# EAGLE design ASL1001 (EAGLE 6.3)
DATABASE: ./../../../../../Components/TinyCircuits_Part_Database.txt
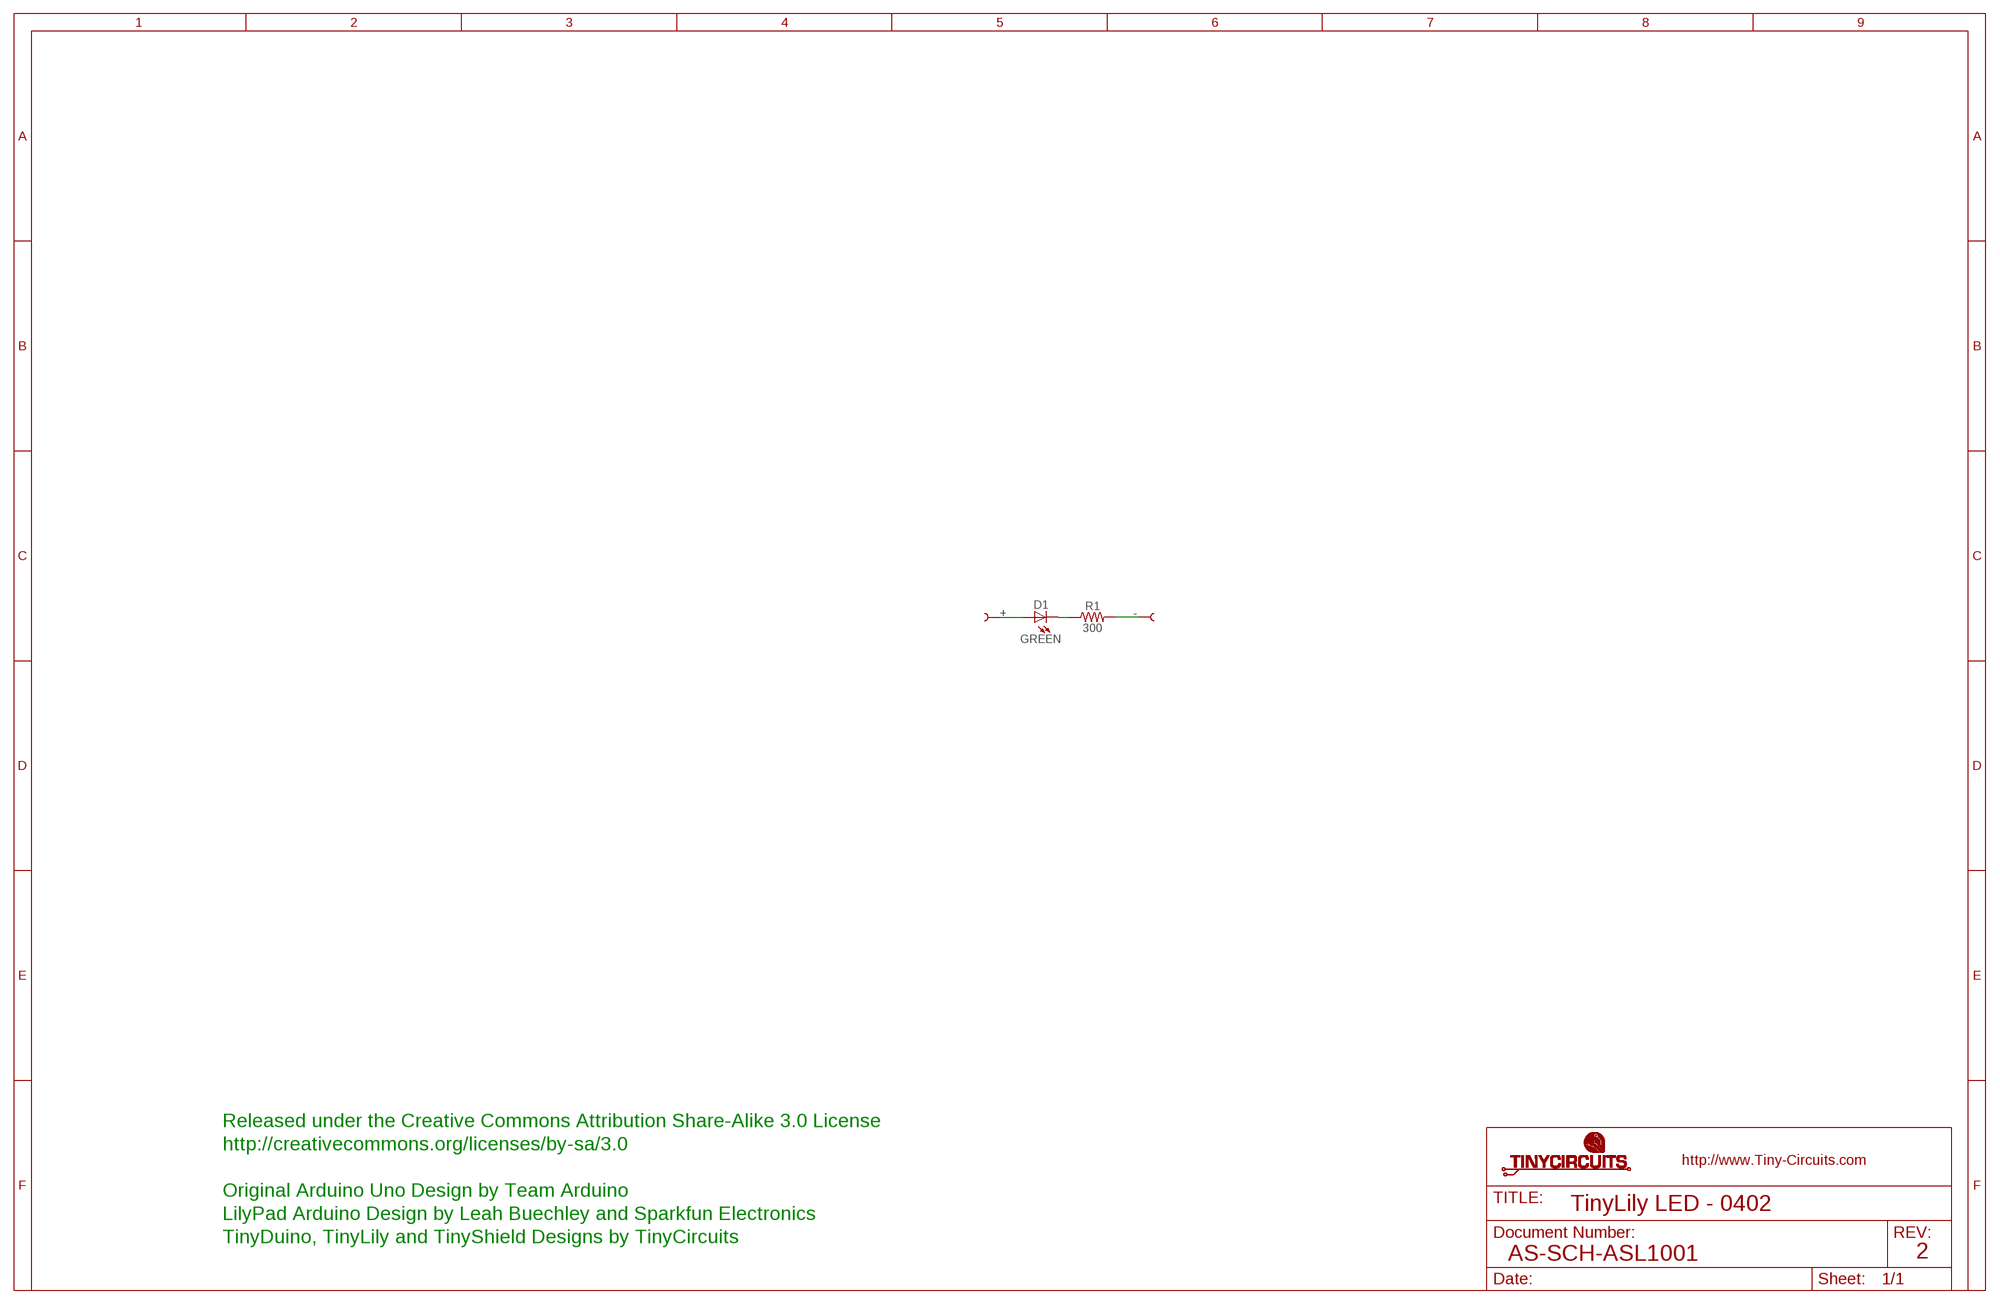
[diagram p0: schematic, sheet 1]

## Parts
D1  GREEN  AS-ITM-00038  [0402_LED]
R1  300  AS-ITM-00016  [0402]
U$1  SEWTABTH_0402  [SEWTAP_TH_0402]
U$7  SEWTABTH_0402  [SEWTAP_TH_0402]

## Nets
+: D1.1(A) U$7.1
-: R1.2 U$1.1
N$2: D1.2(C) R1.1

## Notes on the sheet
- Released under the Creative Commons Attribution Share-Alike 3.0 License
- http://creativecommons.org/licenses/by-sa/3.0
- Original Arduino Uno Design by Team Arduino
- TinyLily LED - 0402
- LilyPad Arduino Design by Leah Buechley and Sparkfun Electronics
- TinyDuino, TinyLily and TinyShield Designs by TinyCircuits
- AS-SCH-ASL1001 | 2

## Library data of the parts
D1 = tinycircuits:AS-ITM-00038: LED 0402 GREEN WTR CLR SMD; PARTNO: AS-ITM-00038
R1 = tinycircuits:AS-ITM-00016: RES 300 OHM 1/16W 1% 0402; PARTNO: AS-ITM-00016
U$1 U$7 = tinycircuits:SEWTAB: TinyLily Sew Tab; BOM: EXCLUDE; DNP: T

## Board
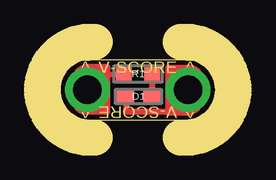
[diagram p1: board, top side]
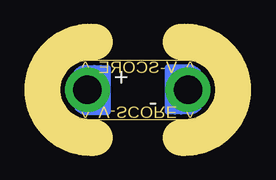
[diagram p2: board, bottom side, seen from below]

Size 6.5 x 2.5 mm. Coordinates in mm from the lower left corner, seen from the top.
Outline: 1.25,2.5 arc180 1.25,0 5.25,0 arc180 5.25,2.5
Outline: 5.25,2.5 1.25,2.5
Outline: 0,2.5 1.25,2.5
Outline: 0,0 6.5,0
Outline: 5.25,2.5 6.5,2.5
Copper layers (1*16): Top 0.035mm / dielectric 1.5mm / Bottom 0.035mm
Design rules "default": minimum track width 8mil, minimum drill 15mil, track to track 6mil, track to pad 6mil, pad to pad 6mil, via to via 6mil, smd to smd 6mil, copper to edge 6mil, drill to drill 8mil, minimum pad ring 8mil, minimum via ring 5mil, stop-mask expansion 4mil, vias tented up to drill 25mil, thermal gap 10mil
Milling: 2 lines

### Footprints (pad centres in the part's own frame; a part is rotated, then mirrored left to right if it is on the bottom)
0402_LED = smd 0.7 x 0.5: 1 -0.55,0; 2 0.55,0
0402 = smd 0.65 x 0.55: 1 -0.6,0; 2 0.6,0
SEWTAP_TH_0402 = drill 1.2 pad 1.867: 1 0,0

### Placement (x,y rotation side)
D1  3.29,0.97 0 top
R1  3.26,1.91 180 top
U$1  1.15,1.25 180 bottom
U$6  [DOCFIELD-TINYCIRCUITS-PCB]  27.25,-18.75 0 top  (outside the outline)
U$7  5.35,1.25 0 bottom

### Tracks (layer width: path | path; a pad name or v marks a point on that pad's centre or on a via)
+
  Top 0.254: D1.1 2.75,0.81 2.75,0.35 4.75,0.35 5.35,1.35 5.41,1.41 U$7.1
-
  Top 0.254: U$1.1 1.56,1.86 R1.2
N$2
  Top 0.254: R1.1 3.84,1.84 D1.2

### Text on the board
Dimension: ^ V-SCORE ^ | ^ V-SCORE ^
bPlace: + | -
Document: FABRICATION DRAWING | NOTES: | 1. PRINTED CIRCUIT BOARD MADE FROM NEMA GRADE FR-4 EPOXY LAMINATE | WITH 1 OUNCE COPPER PLATING AND .024 THICKNESS. | 2. ALL DIMENSIONS ARE GIVEN IN INCHES. | 3. CIRCUIT PATHS ARE FOR REFERENCE ONLY. | 4. HOLE SIZES SHOWN ARE FINISHED DIAMETERS AFTER PLATING. | 5. BOARD PLATED USING REFLOW OR SIMILAR METHOD. | 6. BOARD TO HAVE BLUE SOLDER MASK ON PLATED SURFACES USING WET FILM | 7. SILKSCREEN BOARD USING WHITE INK. | SR100 OR SR1010 EPOXY. EQUIVALENT WET OR DRY FILM MAY BE USED. | 8. THE FOLLOWING INFORMATION APPLIES TO THIS BOARD: | * 2 COPPER LAYERS | * .024 BOARD THICKNESS | * REQUIRES TOP SIDE SILKSCREEN | Released under the Creative Commons Attribution Share-Alike 3.0 License | http://creativecommons.org/licenses/by-sa/3.0 | LilyPad Arduino Design by Leah Buechley and Sparkfun Electronics | Original Arduino Uno Design by Team Arduino | TinyDuino, TinyLily and TinyShield Designs by TinyCircuits | TinyLily LED - 0402 | AS-PCB-ASL1001 | 2